# Altium schematic sheet RoverBreakout2.SchDoc
size A
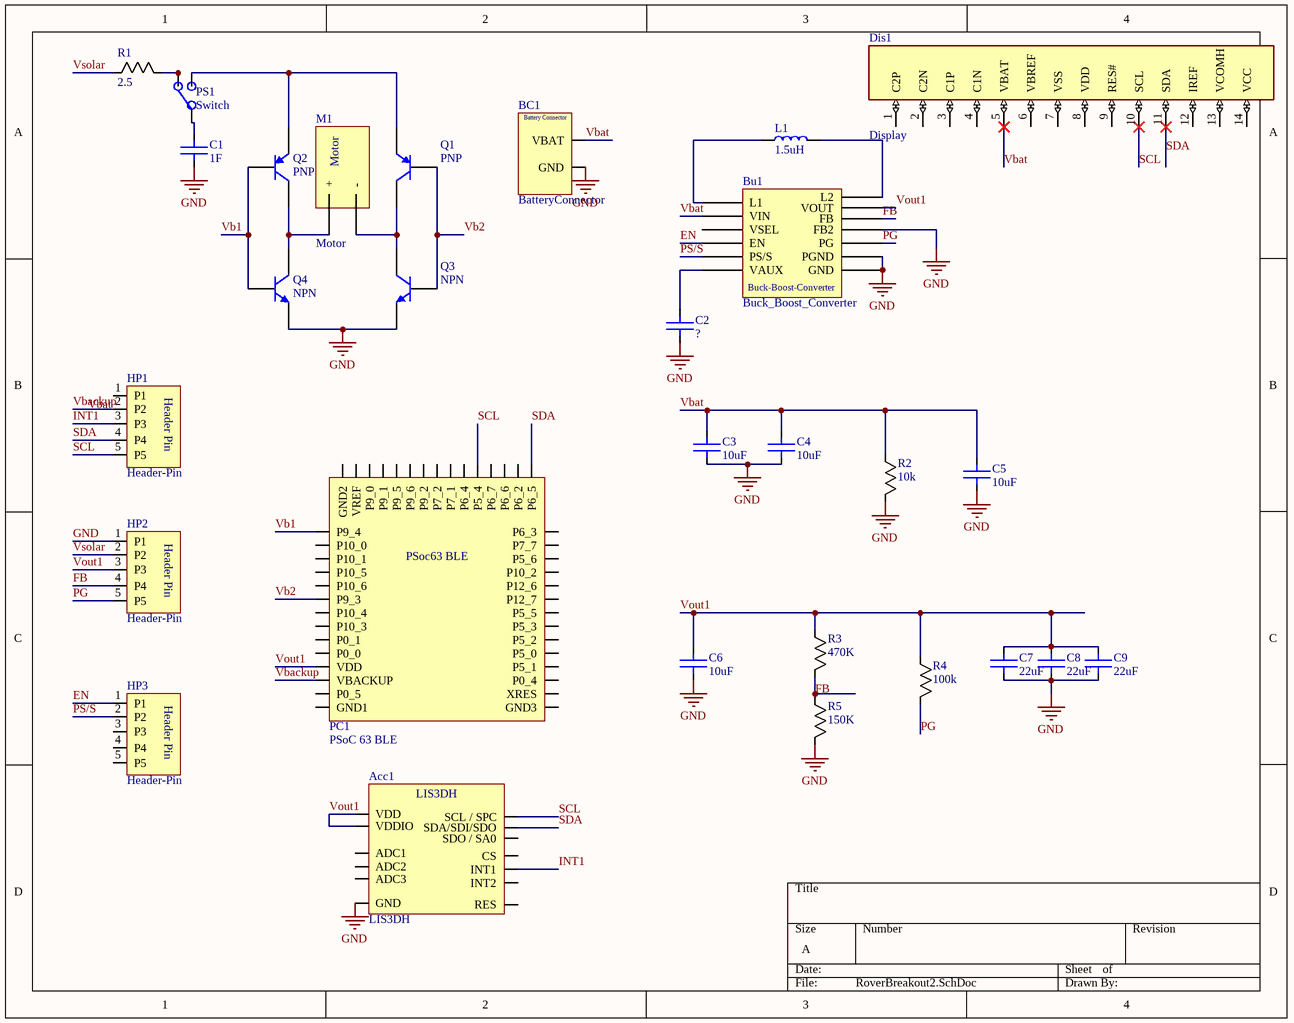
[diagram p0: RoverBreakout2.SchDoc]

## Parts
Acc1  LIS3DH  [LIS3DH]
BC1  BatteryConnector  [BatteryConnector]
Bu1  Buck_Boost_Converter  [Buck_Boost_Converter]
C1  value 1F  [PASSIVE-CAPACITOR-0603]  (hidden comment: Capacitor1)
C2  Capacitor1  [PASSIVE-CAPACITOR-0603]  (value not drawn)
C3  value 10uF  [PASSIVE-CAPACITOR-0603]  (hidden comment: Capacitor1)
C4  value 10uF  [PASSIVE-CAPACITOR-0603]  (hidden comment: Capacitor1)
C5  value 10uF  [PASSIVE-CAPACITOR-0603]  (hidden comment: Capacitor1)
C6  value 10uF  [PASSIVE-CAPACITOR-0603]  (hidden comment: Capacitor1)
C7  value 22uF  [PASSIVE-CAPACITOR-0603]  (hidden comment: Capacitor1)
C8  value 22uF  [PASSIVE-CAPACITOR-0603]  (hidden comment: Capacitor1)
C9  value 22uF  [PASSIVE-CAPACITOR-0603]  (hidden comment: Capacitor1)
Dis1  Display  [Display]
HP1  Header-Pin  [Header_Pin]
HP2  Header-Pin  [Header_Pin]
HP3  Header-Pin  [Header_Pin]
L1  value 1.5uH  [PASSIVE-INDUCTOR-0603]  (hidden comment: Inductor)
M1  Motor  [Motor]
PC1  PSoC 63 BLE  [PSoC-63 BLE]
PS1  Switch  [3-Way Switch]
Q1  PNP  [SOT-23B_N]
Q2  PNP  [SOT-23B_N]
Q3  NPN  [TO-226-AA]
Q4  NPN  [TO-226-AA]
R1  value 2.5  [PASSIVE-RESISTOR-0603]  (hidden comment: Resistor)
R2  value 10k  [PASSIVE-RESISTOR-0603]  (hidden comment: Resistor)
R3  value 470K  [PASSIVE-RESISTOR-0603]  (hidden comment: Resistor)
R4  value 100k  [PASSIVE-RESISTOR-0603]  (hidden comment: Resistor)
R5  value 150K  [PASSIVE-RESISTOR-0603]  (hidden comment: Resistor)

## Nets
GND: Acc1.GND BC1.GND Bu1.FB2 Bu1.GND Bu1.PGND C1.1 C2.1 C3.1 C4.1 C5.1 C6.1 C7.1 C8.1 C9.1 HP2.1(P1) Q3.3(E) Q4.3(E) R2.2 R5.2
EN: Bu1.EN HP3.1(P1)
FB: Bu1.FB HP2.4(P4) R3.2 R5.1
INT1: Acc1.INT1 HP1.3(P3)
PG: Bu1.PG HP2.5(P5) R4.2
PS/S: Bu1.PS/S HP3.2(P2)
SCL: Acc1.SCL_/_SPC Dis1.10(SCL) HP1.5(P5) PC1.25(P5_4)
SDA: Acc1.SDA/SDI/SDO Dis1.11(SDA) HP1.4(P4) PC1.29(P6_5)
Vb1: PC1.14(P9_4) Q2.2(B) Q4.2(B)
Vb2: PC1.9(P9_3) Q1.2(B) Q3.2(B)
Vbackup: HP1.2(P2) PC1.3(VBACKUP)
Vbat: BC1.VBAT Bu1.VIN C3.2 C4.2 C5.2 Dis1.5(VBAT) HP1.1(P1) R2.1
Vout1: Acc1.VDD Acc1.VDDIO Bu1.VOUT C6.2 C7.2 C8.2 C9.2 HP2.3(P3) PC1.4(VDD) R3.1 R4.1
Vsolar: HP2.2(P2) R1.1
NetBu1_L1: Bu1.L1 L1.1
NetBu1_L2: Bu1.L2 L1.2
NetBu1_VAUX: Bu1.VAUX C2.2
NetC1_2: C1.2 PS1.2
NetM1_1: M1.1(+) Q2.1(C) Q4.1(C)
NetM1_2: M1.2(-) Q1.1(C) Q3.1(C)
NetPS1_1: PS1.1 R1.2
NetPS1_3: PS1.3 Q1.3(E) Q2.3(E)

Not connected (* = marked no-connect by the designer): Acc1 ADC1 ADC2 ADC3 CS INT2 RES SDO / SA0; Bu1 VSEL; Dis1 1(C2P) 2(C2N) 3(C1P) 4(C1N) 6(VBREF) 7(VSS) 8(VDD) 9(RES#) 12(IREF) 13(VCOMH) 14(VCC); HP3 3(P3) 4(P4) 5(P5); PC1 1(GND1) 2(P0_5) 5(P0_0) 6(P0_1) 7(P10_3) 8(P10_4) 10(P10_6) 11(P10_5) 12(P10_1) 13(P10_0) 15(GND2) 16(VREF) 17(P9_0) 18(P9_1) 19(P9_5) 20(P9_6) 21(P9_2) 22(P7_2) 23(P7_1) 24(P6_4) 26(P6_7) 27(P6_6) 28(P6_2) 30(P6_3) 31(P7_7) 32(P5_6) 33(P10_2) 34(P12_6) 35(P12_7) 36(P5_5) 37(P5_3) 38(P5_2) 39(P5_0) 40(P5_1) 41(P0_4) 42(XRES) 43(GND3)

## Notes on the sheet
- (in symbol BatteryConnector) Battery Connector
- (in symbol Buck_Boost_Converter) Buck-Boost-Converter
- (in symbol Header-Pin) Header Pin
- (in symbol PSoC 63 BLE) PSoc63 BLE

## Library data of the parts
Q1 Q2 = PNP: PNP Bipolar Transistor; Published: 8-Jun-2000; LatestRevisionDate: 29-May-2009; LatestRevisionNote: IPC-7351 Footprint Added.; PackageVersion: Aug-1999; PackageReference: SOT-23B; Publisher: Altium Limited; PackageDescription: 3-Pin SOT-23 Package 0.95 mm Pitch, 2.4 mm Lead Span
Q3 Q4 = NPN: NPN Bipolar Transistor; Published: 8-Jun-2000; LatestRevisionDate: 17-Jul-2002; LatestRevisionNote: Re-released for DXP Platform.; PackageReference: TO-226-AA; Publisher: Altium Limited; PackageDescription: TO, Flat Index; 3 In-Line, Axial Leads; Body Dia. 4.8mm; Leads 0.55 x 0.51 mm (max); Code_JEDEC: TO-226-AA
R1-R5 = Resistor1
C1-C9 = Capacitor1
  C2: Value: ?